# Altium schematic sheet Micro.SchDoc: NumiClock Micro, WeisTek Engineering
size B; Author: Jeremy G; DrawnBy: Jeremy G
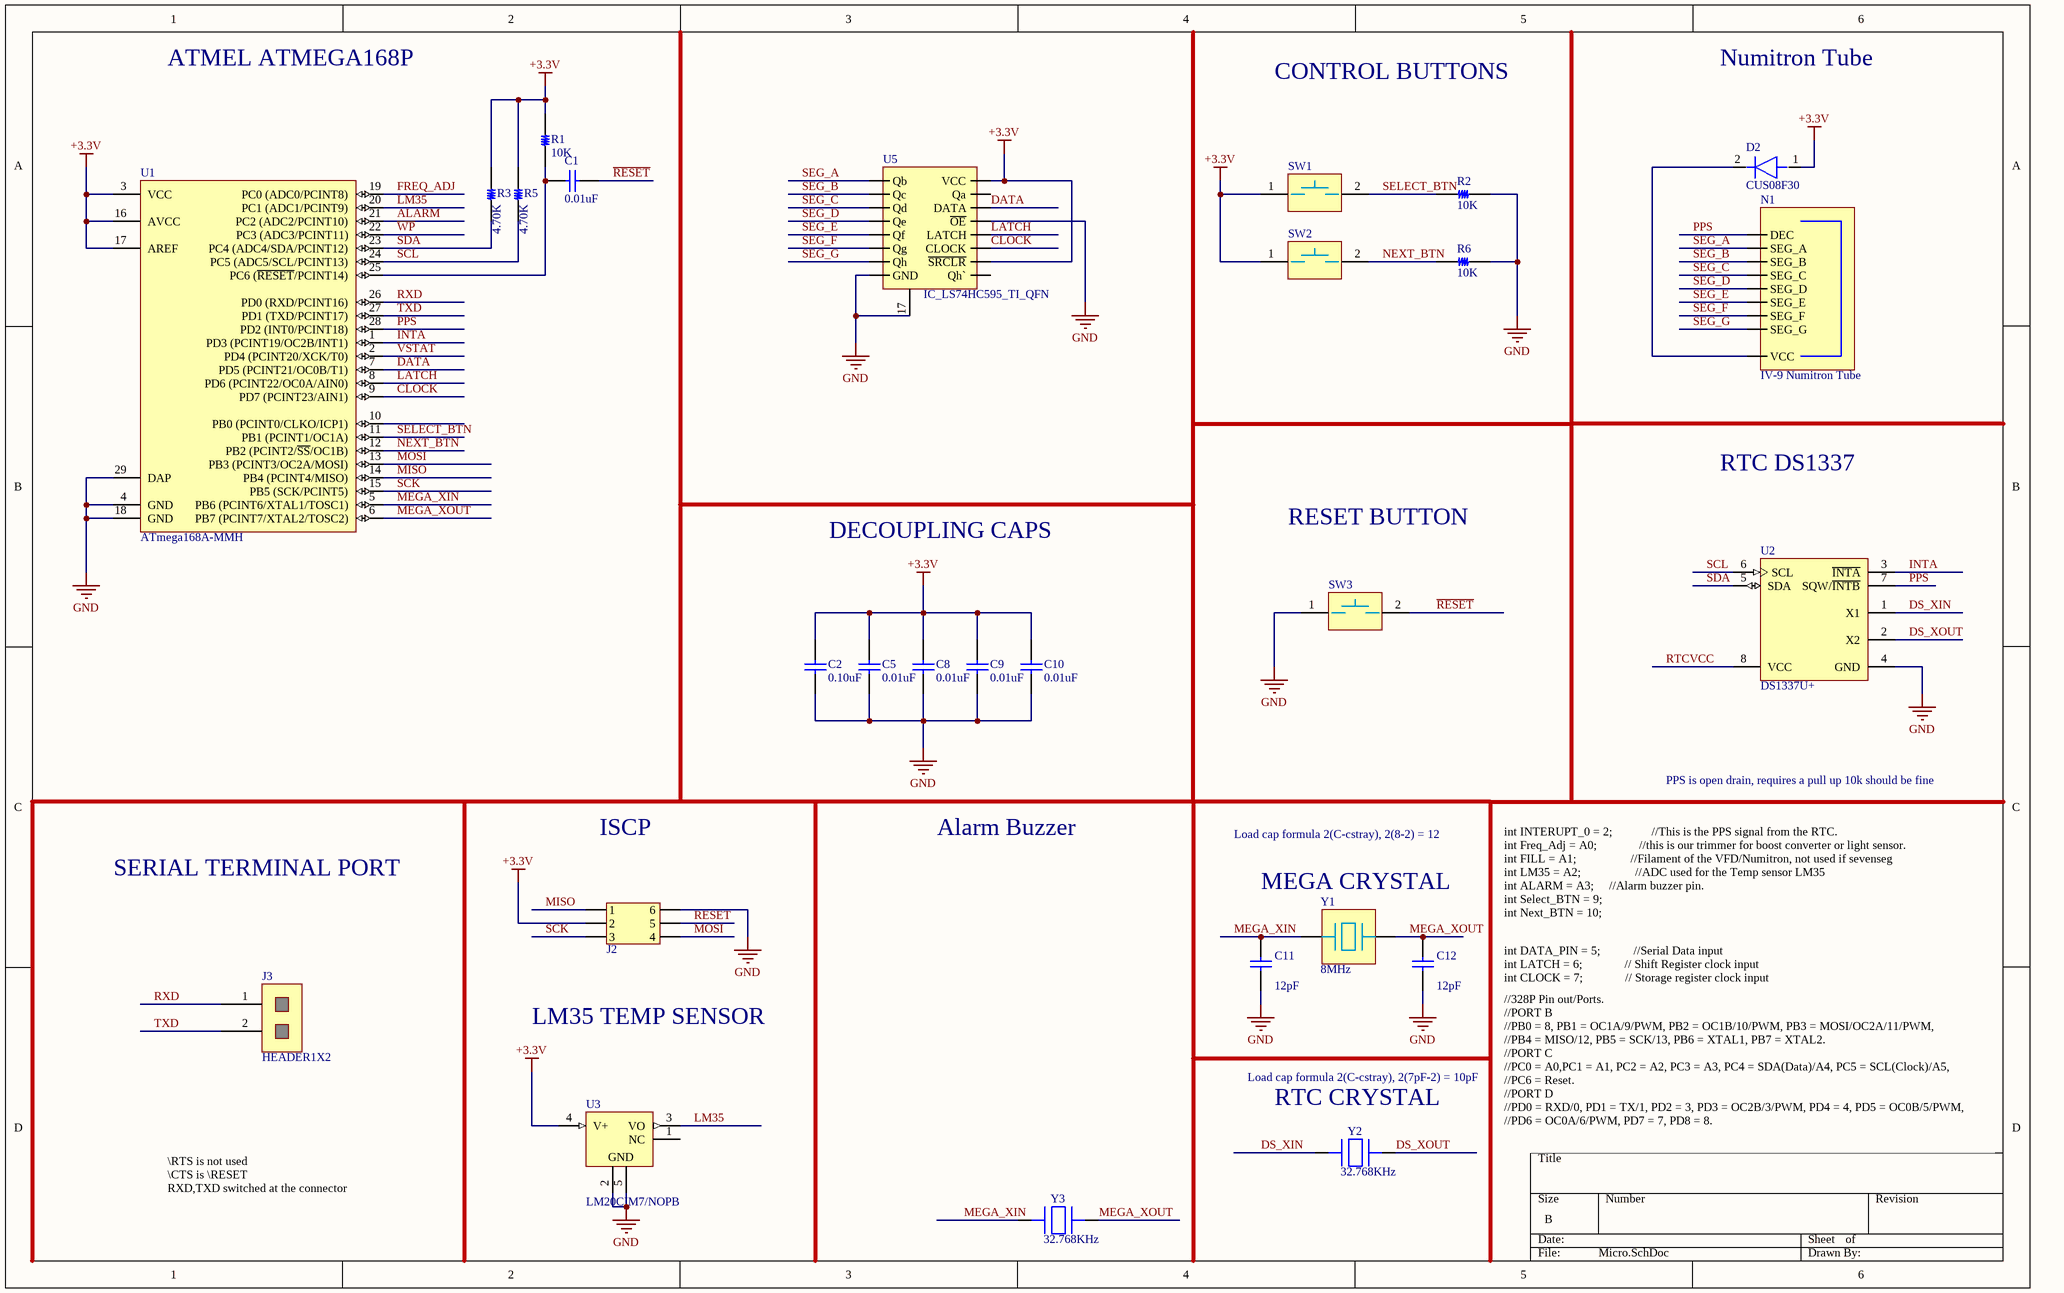
[diagram p0: Micro.SchDoc]

## Parts
C1  value 0.01uF  [C1608N]  (hidden comment: C103_0603_X7R_50V0_5%_Kemet)
C2  value 0.10uF  [C1005N]  (hidden comment: C104_0402_X7R_16V0_10%_Kemet)
C5  value 0.01uF  [C1005N]  (hidden comment: C103_0402_X7R_25.0V_5%_Kemet)
C8  value 0.01uF  [C1005N]  (hidden comment: C103_0402_X7R_25.0V_5%_Kemet)
C9  value 0.01uF  [C1005N]  (hidden comment: C103_0402_X7R_25.0V_5%_Kemet)
C10  value 0.01uF  [C1005N]  (hidden comment: C103_0402_X7R_25.0V_5%_Kemet)
C11  value 12pF  [C1608L]  (hidden comment: C120-0603-COG-NPO-5%)
C12  value 12pF  [C1608L]  (hidden comment: C120-0603-COG-NPO-5%)
D2  CUS08F30  [DIODE-USC]
J2  HEADER 3x2 50mil FCI  [3x2 50mil header_FCI]  (value not drawn)
J3  HEADER1X2  [CONN_2P_SINGLE_100MIL]
N1  IV-9 Numitron Tube  [IV-9 Straight Header]  (no BOM)
R1  10K  [C1005N]
R2  10K  [C1005N]
R3  value 4.70K  [C1005N]  (hidden comment: R472-0402-1%)
R5  value 4.70K  [C1005N]  (hidden comment: R472-0402-1%)
R6  10K  [C1005N]
SW1  SPST-NO_6mm_x_3.5mm  [SPST_NO_6x3.5]  (value not drawn)
SW2  SPST-NO_6mm_x_3.5mm  [SPST_NO_6x3.5]  (value not drawn)
SW3  SPST-NO_6mm_x_3.5mm  [SPST_NO_6x3.5]  (value not drawn)
U1  ATmega168A-MMH  [28M1_N]
U2  DS1337U+  [U8+1_N]
U3  LM20CIM7/NOPB  [MAA05A_N]
U5  IC_LS74HC595_TI_QFN  [QFN50P350X250X100_HS-17N]
Y1  value 8MHz  [NDK_8MHZ_CRYSTAL]  (hidden comment: CRYSTAL_8Mhz_8pF_Micro_NDK)
Y2  32.768KHz  [ABS05]
Y3  32.768KHz  [ABS05]

## Nets
+3.3V: C2.2 C5.2 C8.2 C9.2 C10.2 D2.1 J2.2 R1.2 R3.2 R5.2 SW1.1 SW2.1 U1.3(VCC) U1.16(AVCC) U1.17(AREF) U3.4(V+) U5.10(~{SRCLR}) U5.16(VCC)
GND: C2.1 C5.1 C8.1 C9.1 C10.1 C11.1 C12.1 J2.6 R2.1 R6.1 SW3.1 U1.4(GND) U1.18(GND) U1.29(DAP) U2.4(GND) U3.2(GND) U3.5(GND) U5.8(GND) U5.13(~{OE}) U5.17
~{RESET}: C1.1 J2.5 SW3.2
~{WP}: U1.22(PC3_(ADC3/PCINT11))
ALARM: U1.21(PC2_(ADC2/PCINT10))
CLOCK: U1.9(PD7_(PCINT23/AIN1)) U5.11(CLOCK)
DATA: U1.7(PD5_(PCINT21/OC0B/T1)) U5.14(DATA)
DS_XIN: U2.1(X1) Y2.2
DS_XOUT: U2.2(X2) Y2.1
FREQ_ADJ: U1.19(PC0_(ADC0/PCINT8))
INTA: U1.1(PD3_(PCINT19/OC2B/INT1)) U2.3(~{INTA})
LATCH: U1.8(PD6_(PCINT22/OC0A/AIN0)) U5.12(LATCH)
LM35: U1.20(PC1_(ADC1/PCINT9)) U3.3(VO)
MEGA_XIN: C11.2 U1.5(PB6_(PCINT6/XTAL1/TOSC1)) Y1.1 Y3.2
MEGA_XOUT: C12.2 U1.6(PB7_(PCINT7/XTAL2/TOSC2)) Y1.2 Y3.1
MISO: J2.1 U1.14(PB4_(PCINT4/MISO))
MOSI: J2.4 U1.13(PB3_(PCINT3/OC2A/MOSI))
NEXT_BTN: R6.2 SW2.2 U1.12(PB2_(PCINT2/~{SS}/OC1B))
PPS: N1.2(DEC) U1.28(PD2_(INT0/PCINT18)) U2.7(SQW/~{INTB})
RTCVCC: U2.8(VCC)
RXD: J3.1 U1.26(PD0_(RXD/PCINT16))
SCK: J2.3 U1.15(PB5_(SCK/PCINT5))
SCL: R5.1 U1.24(PC5_(ADC5/SCL/PCINT13)) U2.6(SCL)
SDA: R3.1 U1.23(PC4_(ADC4/SDA/PCINT12)) U2.5(SDA)
SEG_A: N1.5(SEG_A) U5.1(Qb)
SEG_B: N1.3(SEG_B) U5.2(Qc)
SEG_C: N1.4(SEG_C) U5.3(Qd)
SEG_D: N1.8(SEG_D) U5.4(Qe)
SEG_E: N1.9(SEG_E) U5.5(Qf)
SEG_F: N1.6(SEG_F) U5.6(Qg)
SEG_G: N1.7(SEG_G) U5.7(Qh)
SELECT_BTN: R2.2 SW1.2 U1.11(PB1_(PCINT1/OC1A))
TXD: J3.2 U1.27(PD1_(TXD/PCINT17))
VSTAT: U1.2(PD4_(PCINT20/XCK/T0))
NetC1_2: C1.2 R1.1 U1.25(PC6_(~{RESET}/PCINT14))
NetD2_2: D2.2 N1.1(VCC)

Not connected (* = marked no-connect by the designer): U1 10(PB0_(PCINT0/CLKO/ICP1)); U3 1(NC); U5 9(Qh`) 15(Qa)

## Notes on the sheet
- ATMEL ATMEGA168P
- CONTROL BUTTONS
- Numitron Tube
- RTC DS1337
- DECOUPLING CAPS
- RESET BUTTON
- ISCP
- Alarm Buzzer
- Load cap formula 2(C-cstray), 2(8-2) = 12
- PPS is open drain, requires a pull up 10k should be fine
- SERIAL TERMINAL PORT
- MEGA CRYSTAL
- int INTERUPT_0 = 2;             //This is the PPS signal from the RTC.
  int Freq_Adj = A0;              //this is our trimmer for boost converter or light sensor.
  int FILL = A1;                  //Filament of the VFD/Numitron, not used if sevenseg
  int LM35 = A2;                  //ADC used for the Temp sensor LM35
  int ALARM = A3;					//Alarm buzzer pin.
  int Select_BTN = 9;
  int Next_BTN = 10;
- LM35 TEMP SENSOR
- int DATA_PIN = 5;           //Serial Data input
  int LATCH = 6;              // Shift Register clock input
  int CLOCK = 7;              // Storage register clock input
- Load cap formula 2(C-cstray), 2(7pF-2) = 10pF
- (near Y2) RTC CRYSTAL
- //328P Pin out/Ports.
  //PORT B
  //PB0 = 8, PB1 = OC1A/9/PWM, PB2 = OC1B/10/PWM, PB3 = MOSI/OC2A/11/PWM,
  //PB4 = MISO/12, PB5 = SCK/13, PB6 = XTAL1, PB7 = XTAL2.
  //PORT C
  //PC0 = A0,PC1 = A1, PC2 = A2, PC3 = A3, PC4 = SDA(Data)/A4, PC5 = SCL(Clock)/A5,
  //PC6 = Reset.
  //PORT D
  //PD0 = RXD/0, PD1 = TX/1, PD2 = 3, PD3 = OC2B/3/PWM, PD4 = 4, PD5 = OC0B/5/PWM,
  //PD6 = OC0A/6/PWM, PD7 = 7, PD8 = 8.
- \RTS is not used
  \CTS is \RESET
  RXD,TXD switched at the connector

## Library data of the parts
C1 = C103_0603_X7R_50V0_5%_Kemet: CAP CER 10000PF 50V 5% X7R 0603; Manufacturer 1: Kemet; Manufacturer Part Number 1: C0603C103J5RACTU\; Tolerance: 10%; Temperature Stability: +/-15%; Size: 0603; Voltage: 50V; Supplier 1: Digi-Key; Supplier Part number 1: 399-1092-1-ND
C2 = C104_0402_X7R_16V0_10%_Kemet: CAP CER 0.1UF 16V 10% X7R 0402; Manufacturer 1: Kemet; Manufacturer Part Number 1: C0402C104K4RACTU; Supplier 1: Digi-Key; Supplier Part Number 1: 399-3521-1-ND
C5 C8-C10 = C103_0402_X7R_25.0V_5%_Kemet: CAP CER 10000PF 25V 5% X7R 0402; Manufacturer 1: Kemet; Manufacturer Part Number 1: C0402C103J3RACTU; Tolerance: 5%; Voltage: 25V; Supplier 1: Digi-Key; Supplier Part Number 1: 399-1279-1-ND
C11 C12 = C120-0603-C0G-NPO-5%_TDK: CAP CER 12PF 50V 5% C0G 0603; Voltage Rating: 50V; Supplier 1: Digi-Key; Supplier Part Number 1: 445-1270-1-ND
D2 = DIODE-CUS08F30-30v-800MA-USC-Toshiba: DIODE SCHOTTKY 30V 800MA USC; Manufacturer 1: Toshiba Semiconductor and Storage; Manufacturer Part Number 1: CUS08F30,H3F; Supplier 1: Digi-Key; Supplier Part Number 1: CUS08F30H3FCT-ND
J2 = HEADER 3x2 50mil FCI: CONN HEADER 6POS DL UNSHRD SMD; Manufacturer Part Number 1: 20021121-00006C4LF; Supplier 1: Digi-key; Supplier Part Number 1: 609-3693-1-ND; Manufacturer 1: FCI
J3 = CONN_2P_Header: Manufacturer: MOLEX; PART DESC: CONN HEADER 3POS .100" SGL GOLD; Digikey: WM6436-ND; Package/Size: Through hole; PART NUMBER: 22-28-4360; HelpURL: http://search.digikey.com/scripts/DkSearch/dksus.dll?WT.z_header=search_go&lang=en&site=us&keywords=WM6436-ND&x=14&y=15; Supplier 1: Digi-Key; Supplier Part Number 1: SAM1035-50-ND
R1 R2 R6 = R103_0402_5%_Panasonic: RES 10K OHM 1/10W 5% 0402 SMD; Manufacturer 1: Panasonic Electronic Components; Manufacturer Part Number 1: ERJ-2GEJ103X; Tolerance: 5%; Supplier 1: Digi-Key; Supplier Part Number 1: P10KJCT-ND; Value: 10K
R3 R5 = R472-0402-1%: RES 4.7K OHM 1/10W 1% 0402 SMD; Power Rating: 100mW; Temperature Coefficient: +-100ppm/C; Tolerance: 1%; Supplier 1: Digi-Key; Supplier Part Number 1: P4.70KLCT-ND; Package/Size: 0402
SW1-SW3 = SPST-NO_6mm_x_3.5mm: SWITCH TACTILE SPST-NO 0.05A 24V; Supplier 1: Digi-key; Supplier Part Number 1: 450-2146-1-ND
U1 = ATmega168A-MMH: 8-bit AVR Microcontroller, 16KB Flash, 512 Bytes EEPROM, 1KB SRAM, 28-pin VQFN, Industrial Grade (-40°C to 85°C); DatasheetVersion: revD, May-2011; PackageVersion: revB, Nov-2008; PackageReference: 28M1; PackageDescription: 28-pad, 4x4x1.0mm Body, Pitch 0.45mm, 2.4x2.4mm Exposed Pad, Plastic Very Thin QFN Package (VQFN); ComponentLink1Description: Manufacturer URL; ComponentLink1URL: http://www.atmel.com/; ComponentLink2Description: ATmega48A/48PA/88A/88PA/168A/168PA/328/328P Datasheet; ComponentLink2URL: http://www.atmel.com/dyn/resources/prod_documents/8271.pdf; ComponentLink3Description: ATmega48A/48PA/88A/88PA/168A/168PA/328/328P Summary; ComponentLink3URL: http://www.atmel.com/dyn/resources/prod_documents/8271S.pdf; Supplier 1: Digi-key; Supplier Part Number 1: ATMEGA168A-MMH-ND
U2 = DS1337U+: I2C Serial Real-Time Clock, 8-Pin uSOP, -40 to 85 degC, Pb-Free; DatasheetVersion: Sep-2009; PackageVersion: revL, 2009; PackageReference: U8+1; PackageDescription: 8-Pin Micro-MAX, Thin Shrink Small-Outline, 0.65 mm Pitch, uMAX, uSOP, Pb-Free; Code_JEDEC: MO-187-AA; ComponentLink1Description: Manufacturer URL; ComponentLink1URL: http://www.maxim-ic.com; ComponentLink2Description: Datasheet; ComponentLink2URL: http://datasheets.maxim-ic.com/en/ds/DS1337-DS1337C.pdf; ComponentLink3Description: Package Specification; ComponentLink3URL: http://pdfserv.maxim-ic.com/package_dwgs/21-0036.PDF; Supplier 1: Digi-Key; Supplier Part Number 1: DS1337U+-ND
U3 = LM20CIM7/NOPB: 2.4V, 10µA Temperature Sensor, 5-pin SC-70 Micro SMD, Pb-Free; Manufacturer: National Semiconductor; PackageTopMarking: T2C*XTT; PowerWise: N; CompType: Temp Sensor IC; High-Reliability: Y; DatasheetVersion: Jan-2010; PackageVersion: revD, Jun-2007; PackageReference: MAA05A; PackageDescription: Molded SC-70, 2 x 1.25 x .9mm, 5 Lead, 0.65mm Pitch; PartNumber: LM20CIM7/NOPB; RoHS: Y; PinCount: 5; Code_JEITA: SC-88A; Code_JEDEC: MO-203-AA; Code_IPC: SOT353-5; ComponentLink1Description: Manufacturer URL; ComponentLink1URL: http://www.national.com/; ComponentLink2Description: LM20 Datasheet; ComponentLink2URL: http://www.national.com/ds/LM/LM20.pdf; ComponentLink3Description: LM20 Web Page; ComponentLink3URL: http://www.national.com/pf/LM/LM20.html; ComponentLink4Description: MAA05A Package Page; ComponentLink4URL: http://www.national.com/packaging/folders/maa05a.html; Supplier 1: Digi-key; Supplier Part Number 1: LM20CIM7/NOPBCT-ND
U5 = IC_LS74HC595_TI_QFN: IC 8-BIT SHIFT REGISTER 16-DIP; Manufacturer 1: Texas Instruments; Manufacturer Part Number 1: SN74HC595N; Supplier 1: Digi-Key; Supplier Part Number 1: 568-2719-1-ND
Y1 = CRYSTAL_8Mhz_8pF_Micro_NDK: Crystal 8.0000MHz 50ppm 8pF 500 Ohm -40°C - 150°C AEC-Q200 Surface Mount 2-SMD; Supplier 1: Digi-Key; Supplier Part Number 1: 644-1178-1-ND
Y2 Y3 = CRYSTAL-32.768KHZ_ABS-Micro: Crystal 32.7680kHz 20ppm 12.5pF 90 kOhm -40°C - 85°C Surface Mount 2-SMD; Supplier 1: Digi-Key; Supplier Part Number 1: 535-11899-1-ND; VALUE: 32.768KHz